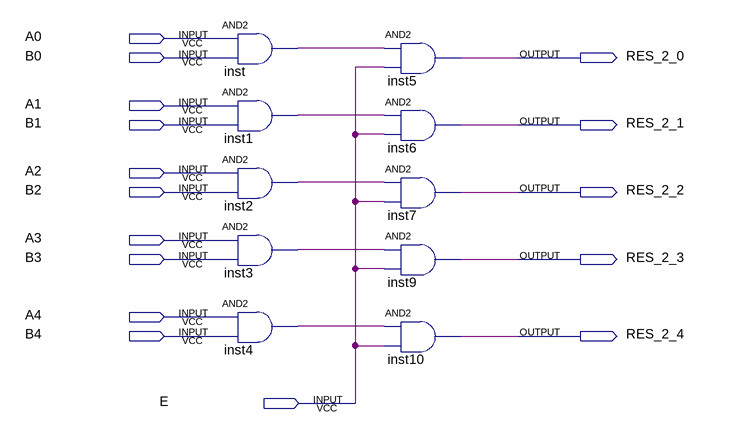
[diagram p0: schematic sheet]
// Quartus schematic AND_BITS.bdf as structural Verilog: 10 symbols, 16 pins
module AND_BITS (
  input  A0,
  input  B0,
  input  A1,
  input  B1,
  input  A2,
  input  B2,
  input  A3,
  input  B3,
  input  A4,
  input  B4,
  input  E,
  output RES_2_0,
  output RES_2_1,
  output RES_2_2,
  output RES_2_3,
  output RES_2_4
);

  wire inst1_out, inst2_out, inst3_out, inst4_out, inst_out;

  and inst (inst_out, A0, B0);
  and inst1 (inst1_out, A1, B1);
  and inst2 (inst2_out, A2, B2);
  and inst3 (inst3_out, A3, B3);
  and inst4 (inst4_out, A4, B4);
  and inst5 (RES_2_0, inst_out, E);
  and inst6 (RES_2_1, inst1_out, E);
  and inst7 (RES_2_2, inst2_out, E);
  and inst9 (RES_2_3, inst3_out, E);
  and inst10 (RES_2_4, inst4_out, E);
endmodule
